# Altium schematic sheet LightLinkV2.SchDoc
size B; SheetNumber: 1; SheetTotal: 4
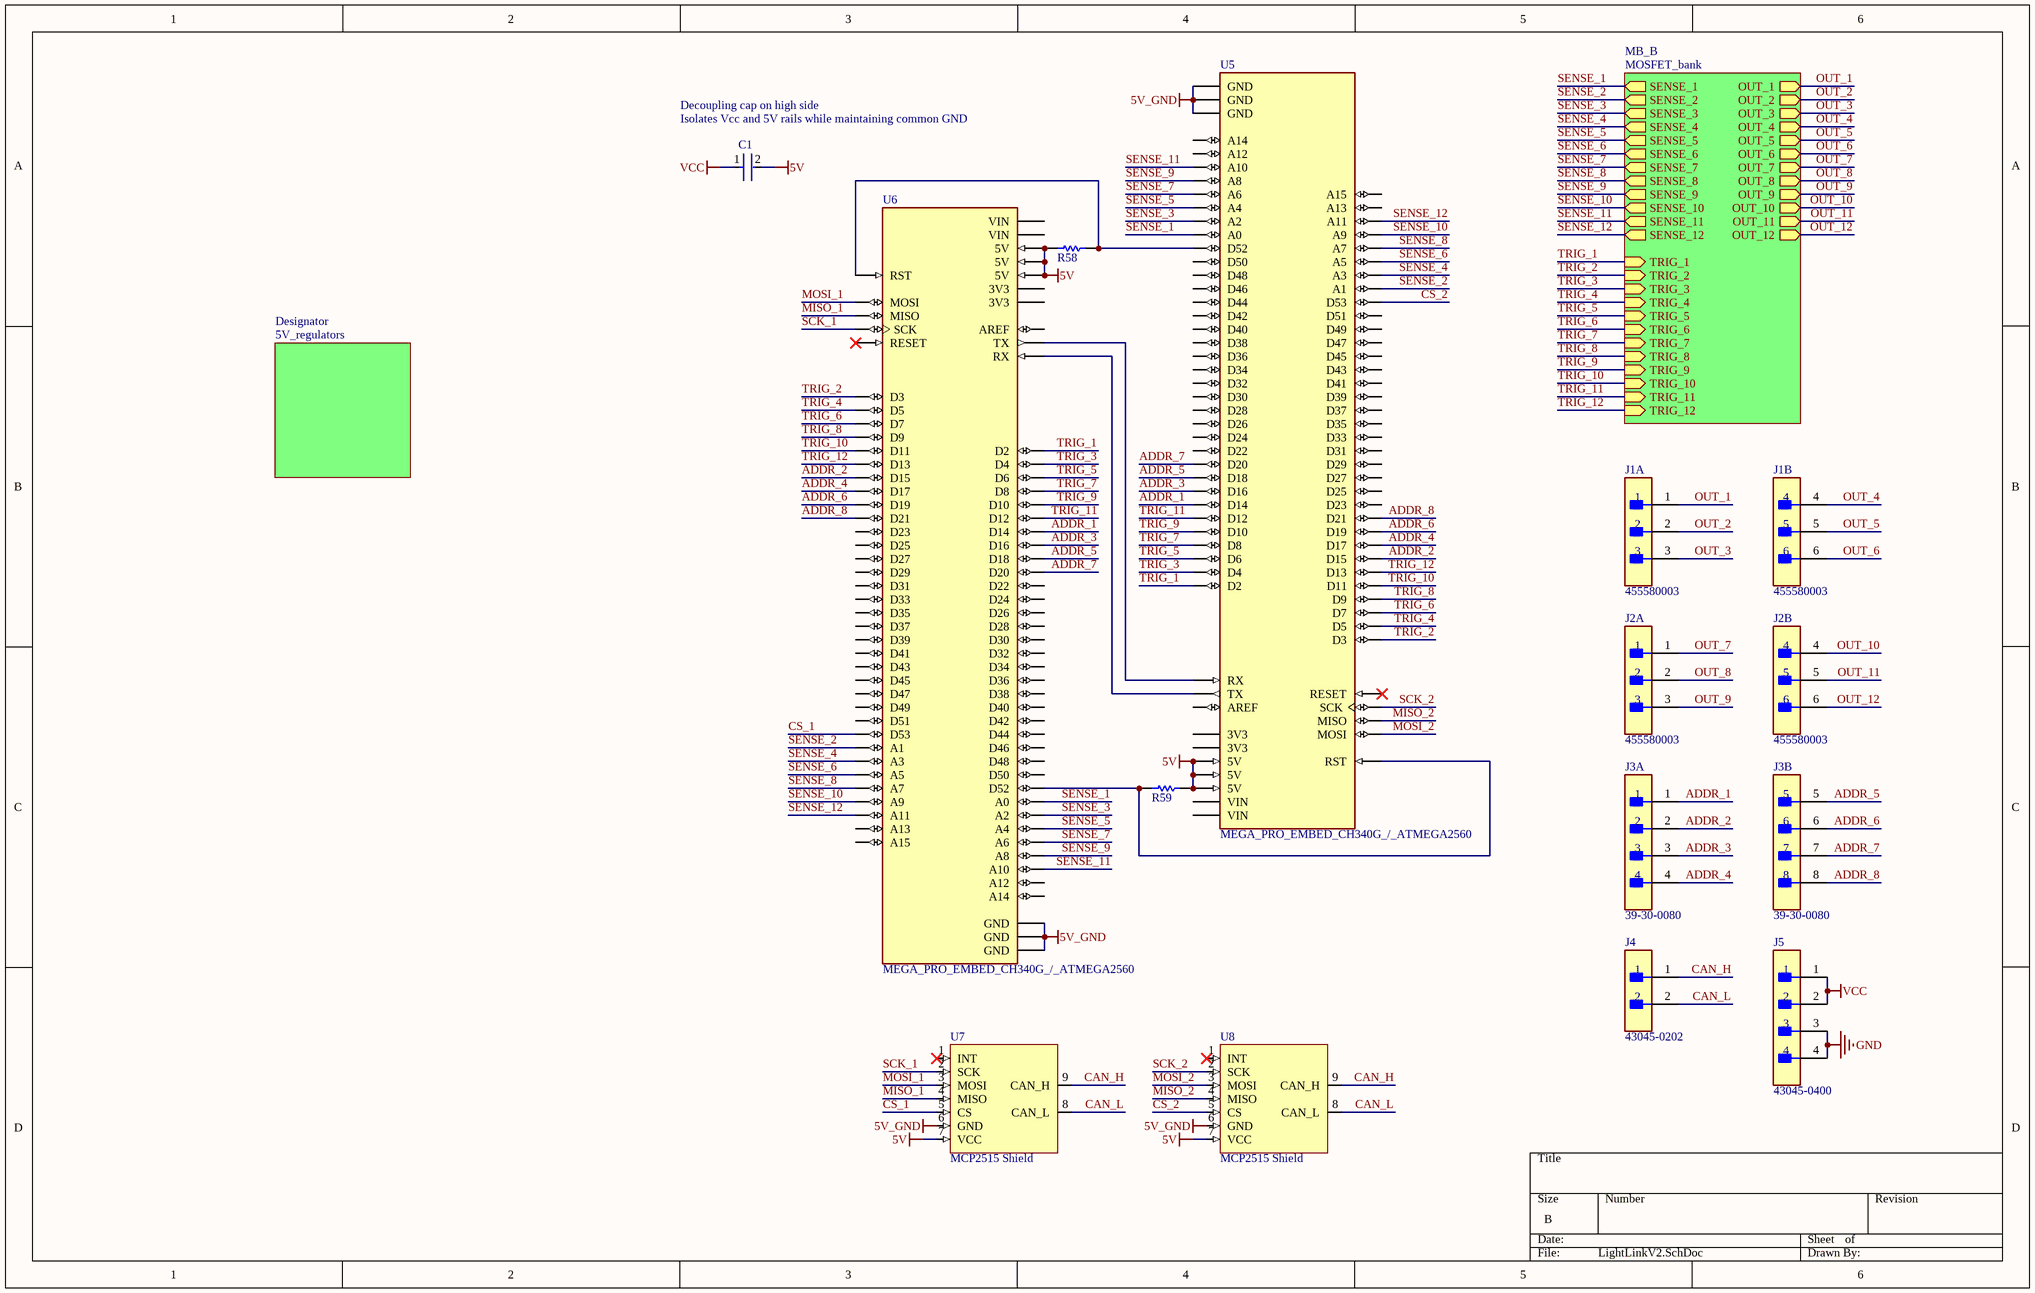
[diagram p0: LightLinkV2.SchDoc]

## Parts
C1  C0603C103K5RACTU  [FP-C0603C-CF-MFG]  (value not drawn)
J1  455580003  [FP-455580003-MFG]  (parts A,B of 2)
J2  455580003  [FP-455580003-MFG]  (parts A,B of 2)
J3  39-30-0080  [FP-39-30-0080-MFG]  (parts A,B of 2)
J4  43045-0202  [FP-43045-0202-MFG]
J5  43045-0400  [FP-43045-0400-MFG]
R58  ERJ3EKF1002V  [RESC1609X55X30LL15T15]  (value not drawn)
R59  ERJ3EKF1002V  [RESC1609X55X30LL15T15]  (value not drawn)
U5  MEGA_PRO_EMBED_CH340G_/_ATMEGA2560  [MODULE_MEGA_PRO_EMBED_CH340G_/_ATMEGA2560]
U6  MEGA_PRO_EMBED_CH340G_/_ATMEGA2560  [MODULE_MEGA_PRO_EMBED_CH340G_/_ATMEGA2560]
U7  MCP2515 Shield  [MCP2515 Shield-Footprint-1]
U8  MCP2515 Shield  [MCP2515 Shield-Footprint-1]

## Sub-sheets
Designator = 5V_regulators: no entries
MB_B = MOSFET_bank: SENSE_1 (out), SENSE_2 (out), SENSE_3 (out), SENSE_4 (out), TRIG_1 (in), OUT_1 (out), TRIG_2 (in), OUT_2 (out), TRIG_3 (in), OUT_3 (out), TRIG_4 (in), OUT_4 (out), SENSE_5 (out), SENSE_6 (out), SENSE_7 (out), SENSE_8 (out), TRIG_5 (in), OUT_5 (out), TRIG_6 (in), OUT_6 (out), TRIG_7 (in), OUT_7 (out), TRIG_8 (in), OUT_8 (out), SENSE_9 (out), SENSE_10 (out), SENSE_11 (out), SENSE_12 (out), TRIG_9 (in), OUT_9 (out), TRIG_10 (in), OUT_10 (out), TRIG_11 (in), OUT_11 (out), TRIG_12 (in), OUT_12 (out)

## Nets
5V: C1.2 R58.2 R59.1 U5.5V_1(5V) U5.5V_2(5V) U5.5V_3(5V) U6.5V_1(5V) U6.5V_2(5V) U6.5V_3(5V) U7.7(VCC) U8.7(VCC)
5V_GND: U5.GND_1(GND) U5.GND_2(GND) U5.GND_3(GND) U6.GND_1(GND) U6.GND_2(GND) U6.GND_3(GND) U7.6(GND) U8.6(GND)
GND: J5.3 J5.4
VCC: C1.1 J5.1 J5.2
ADDR_1: J3.1 U5.D14 U6.D14
ADDR_2: J3.2 U5.D15 U6.D15
ADDR_3: J3.3 U5.D16 U6.D16
ADDR_4: J3.4 U5.D17 U6.D17
ADDR_5: J3.5 U5.D18 U6.D18
ADDR_6: J3.6 U5.D19 U6.D19
ADDR_7: J3.7 U5.D20 U6.D20
ADDR_8: J3.8 U5.D21 U6.D21
CAN_H: J4.1 U7.9(CAN_H) U8.9(CAN_H)
CAN_L: J4.2 U7.8(CAN_L) U8.8(CAN_L)
CS_1: U6.D53 U7.5(CS)
CS_2: U5.D53 U8.5(CS)
MISO_1: U6.MISO U7.4(MISO)
MISO_2: U5.MISO U8.4(MISO)
MOSI_1: U6.MOSI U7.3(MOSI)
MOSI_2: U5.MOSI U8.3(MOSI)
OUT_1: J1.1 ; sheet MB_B/OUT_1
OUT_2: J1.2 ; sheet MB_B/OUT_2
OUT_3: J1.3 ; sheet MB_B/OUT_3
OUT_4: J1.4 ; sheet MB_B/OUT_4
OUT_5: J1.5 ; sheet MB_B/OUT_5
OUT_6: J1.6 ; sheet MB_B/OUT_6
OUT_7: J2.1 ; sheet MB_B/OUT_7
OUT_8: J2.2 ; sheet MB_B/OUT_8
OUT_9: J2.3 ; sheet MB_B/OUT_9
OUT_10: J2.4 ; sheet MB_B/OUT_10
OUT_11: J2.5 ; sheet MB_B/OUT_11
OUT_12: J2.6 ; sheet MB_B/OUT_12
SCK_1: U6.SCK U7.2(SCK)
SCK_2: U5.SCK U8.2(SCK)
SENSE_1: U5.A0 U6.A0 ; sheet MB_B/SENSE_1
SENSE_2: U5.A1 U6.A1 ; sheet MB_B/SENSE_2
SENSE_3: U5.A2 U6.A2 ; sheet MB_B/SENSE_3
SENSE_4: U5.A3 U6.A3 ; sheet MB_B/SENSE_4
SENSE_5: U5.A4 U6.A4 ; sheet MB_B/SENSE_5
SENSE_6: U5.A5 U6.A5 ; sheet MB_B/SENSE_6
SENSE_7: U5.A6 U6.A6 ; sheet MB_B/SENSE_7
SENSE_8: U5.A7 U6.A7 ; sheet MB_B/SENSE_8
SENSE_9: U5.A8 U6.A8 ; sheet MB_B/SENSE_9
SENSE_10: U5.A9 U6.A9 ; sheet MB_B/SENSE_10
SENSE_11: U5.A10 U6.A10 ; sheet MB_B/SENSE_11
SENSE_12: U5.A11 U6.A11 ; sheet MB_B/SENSE_12
TRIG_1: U5.D2 U6.D2 ; sheet MB_B/TRIG_1
TRIG_2: U5.D3 U6.D3 ; sheet MB_B/TRIG_2
TRIG_3: U5.D4 U6.D4 ; sheet MB_B/TRIG_3
TRIG_4: U5.D5 U6.D5 ; sheet MB_B/TRIG_4
TRIG_5: U5.D6 U6.D6 ; sheet MB_B/TRIG_5
TRIG_6: U5.D7 U6.D7 ; sheet MB_B/TRIG_6
TRIG_7: U5.D8 U6.D8 ; sheet MB_B/TRIG_7
TRIG_8: U5.D9 U6.D9 ; sheet MB_B/TRIG_8
TRIG_9: U5.D10 U6.D10 ; sheet MB_B/TRIG_9
TRIG_10: U5.D11 U6.D11 ; sheet MB_B/TRIG_10
TRIG_11: U5.D12 U6.D12 ; sheet MB_B/TRIG_11
TRIG_12: U5.D13 U6.D13 ; sheet MB_B/TRIG_12
NetR58_1: R58.1 U5.D52 U6.RST
NetR59_2: R59.2 U5.RST U6.D52
NetU5_RX: U5.RX U6.TX
NetU5_TX: U5.TX U6.RX

Not connected (* = marked no-connect by the designer): U5 3V3_1(3V3) 3V3_2(3V3) A12 A13 A14 A15 AREF D22 D23 D24 D25 D26 D27 D28 D29 D30 D31 D32 D33 D34 D35 D36 D37 D38 D39 D40 D41 D42 D43 D44 D45 D46 D47 D48 D49 D50 D51 RESET* VIN_1(VIN) VIN_2(VIN); U6 3V3_1(3V3) 3V3_2(3V3) A12 A13 A14 A15 AREF D22 D23 D24 D25 D26 D27 D28 D29 D30 D31 D32 D33 D34 D35 D36 D37 D38 D39 D40 D41 D42 D43 D44 D45 D46 D47 D48 D49 D50 D51 RESET* VIN_1(VIN) VIN_2(VIN); U7 1(INT)*; U8 1(INT)*

## Notes on the sheet
- Decoupling cap on high side
- (near C1) Isolates Vcc and 5V rails while maintaining common GND

## Library data of the parts
C1 = CMP-2006-03046-3: CAP CER 10000PF 50V X7R 0603; Manufacturer: KEMET; Temperature Coefficient: 30ppm/°C; Capacitance: 10,000 pF; Automotive Grade: Grade 1; Material: Ceramic; Value: 10,000 pF; Tolerance: 0.1; Voltage Rating: 50 V; Digikey Description: CAP CER 10000PF 50V X7R 0603; ComponentLink2Description: Datasheet; Mouser Description: Ceramic Capacitor 0.01Uf, 50V, X7R, 10%, 0603, Full Reel; ComponentLink2URL: https://api.kemet.com/component-edge/download/datasheet/C0603C100J5GACAUTO.pdf; Package: C0603C-CF; RoHS: TRUE; Octopart: https://octopart.com/c0603c103k5ractu-kemet-133094; Device Class L1: Passive Components; Manufacturer Part Number: C0603C103K5RACTU; Temperature Range Low: -55°C; Automotive: Yes; Category: Cap; Lead Free: Yes; Temperature: -55°C to +125°C; Temperature Range High: +125°C; Temperature Characteristic: X7R; Height: 0.87mm; Device Class L3: Ceramic Capacitors; Device Class L2: Capacitors
J1 J2 = CMP-04776-000024-1: CONN HEADER R/A 6POS 4.2MM; Manufacturer: Molex; Standoff Height: 0.4mm; Conn Orientation: Right Angle; Number Of Contacts: 6; Conn Gender: Male; Voltage Rating: 600V; Current Rating: 8A; Footprint Url: https://www.molex.com/pdm_docs/sd/455580003_sd.pdf; Number Of Rows: 2; Lead Free: Yes; Digikey Description: CONN HEADER R/A 6POS 4.2MM; ComponentLink2URL: https://www.molex.com/webdocs/datasheets/pdf/en-us/0455580003_PCB_HEADERS.pdf; Octopart: https://octopart.com/45558-0003-molex-7672845; Package: 0; Device Class L3: unset; ComponentLink2Description: Datasheet; Device Class L2: Headers and Wire Housings; Category: Conn; Contact Material: Tin,Nickel; Mouser Description: Conn Power HDR 6 POS 4.2mm Solder ST Thru-Hole 6 Terminal 1 Port Mini-Fit Jr™ Tray; Manufacturer Part Number: 455580003; Pitch: 4.2mm; Device Class L1: Connectors; Temperature Range Low: -40°C; Temperature: -40°C to +105°C; RoHS: TRUE; Temperature Range High: +105°C; Height: 10.38mm; Automotive: No
J3 = CMP-04776-000387-1: CONN HEADER R/A 8POS 4.2MM; Number of Contacts: 8; Max Voltage Rating (AC): 600V; Insulation Resistance: 1GR; Contact Resistance: 10mR; Max Current Rating: 7A; Gender: Male; Row Spacing: 0.165inch; Approvals: UL; Number of Ports: 1; Current Rating: 13A; Glow Wire Compliant: Non-compliant; Pitch: 4.2mm; Housing Material: Nylon; Color: Natural; Max Operating Temperature: 105°C; Packaging: Bag; Termination: Solder; Flammability Rating: UL94 V-0; Width: 11.4mm; Contact Plating: Tin; Material: Nylon; Mount: Through Hole; Height: 11.4mm; Halogen Free: Low Halogen; Depth: 19.4mm; ELV: Compliant; Number of Terminals/Pins: 8; Orientation: Right Angle; Number of Positions: 8; Contact Material: Brass; Number of Rows: 2; Lead Free: Lead Free; Contact Type: Male Pin; Min Operating Temperature: -40°C; Fastening Type: Ramp; Package Quantity: 225; Voltage Rating (DC): 600V; Number of Circuits: 8; Housing Color: Natural; Voltage Rating: 600V; Series: Mini-Fit® Jr™ 5569; Contact Gender: Male; Length: 18mm
J4 = CMP-04776-000660-1: CONN HEADER R/A 2POS; Number of Contacts: 2; Current Rating: 5A; Gender: Male; Contact Resistance: 10mR; Voltage Rating (DC): 250V; Glow Wire Compliant: Compliant; Voltage Rating: 600V; Pitch: 3mm; Max Voltage Rating (DC): 250.25kV; Insulation Resistance: 1GR; Radiation Hardening: No; Halogen Free: Low Halogen; Number of Positions: 2; Mount: Through Hole; RoHS Compliant: Yes; Lead Free: Contains Lead; Color: Black; Max Current Rating: 5A; Length: 7.15mm; Orientation: Right Angle; Termination: Solder; Height: 8.77mm; Flammability Rating: UL94 V-0; Diameter: 3mm; Min Operating Temperature: -40°C; Series: Micro-Fit 3.0; Max Operating Temperature: 105°C; Number of Circuits: 2; Number of Rows: 2; Depth: 12.2mm; Housing Color: Black; Contact Plating: Gold; Case/Package: SMC; Contact Material: Brass; Packaging: Tray; Housing Material: Thermoplastic; Package Quantity: 3168
J5 = CMP-04776-000002-1: CONN HEADER R/A 4POS 3MM; Manufacturer: Molex; Conn Gender: Male; Conn Orientation: Right Angle; Voltage Rating: 600V; Number Of Contacts: 4; Is Female: yes; Current Rating: 8.5A; ComponentLink2URL: https://www.molex.com/webdocs/datasheets/pdf/en-us/0430450400_PCB_HEADERS.pdf; Manufacturer Part Number: 43045-0400; Digikey Description: CONN HEADER R/A 4POS 3MM; Category: Conn; Temperature Range High: +105°C; Lead Free: Yes; Device Class L1: Connectors; Automotive: No; Temperature: -40°C to +105°C; Footprint Url: https://www.molex.com/pdm_docs/sd/430450400_sd.pdf; Height: 9.27mm; Number Of Rows: 2; Device Class L3: unset; Pitch: 3mm; Temperature Range Low: -40°C; Contact Material: Tin,Nickel; Octopart: https://octopart.com/43045-0400-molex-287063; RoHS: TRUE; ComponentLink2Description: Datasheet; Package: 43045-0400; Device Class L2: Headers and Wire Housings
R58 R59 = CMP-1012-00623-3: Chip Resistor, 10 KOhm, +/- 1%, 0.1 W, -55 to 155 degC, 0603 (1608 Metric), RoHS, Tape and Reel; Manufacturer: Panasonic; Voltage Rating: 75V; Case\/Package: 0603; Power Rating: 100mW; Resistance: 10KOhm; Temperature Coefficient: 100ppm\/degreesC; Number of Pins: 2; Package Reference: 603; Depth: 0.8mm; Mount: SurfaceMount; Package Description: 2-Pin Surface Mount Device, Body 1.6 x 0.85 mm; Datasheet Version: 02/2017; Length: 1.6mm; Lead Free: LeadFree; Height: 0.45mm; Number of Terminations: 2; Max Power Dissipation: 100mW; Min Operating Temperature: -55degC; Datasheet URL: https://industrial.panasonic.com/cdbs/www-data/pdf/RDA0000/AOA0000C304.pdf; Termination: SMD/SMT; Case Code (Metric): 1608; Case Code (Imperial): 0603; Tolerance: 1%; Max Operating Temperature: 155degC; RoHSCompliant: true; Voltage Rating (DC): 75V; Radiation Hardening: No; Packaging: TapeandReel; Composition: ThickFilm; Mounting Technology: SurfaceMount; Manufacturer URL: http://www.panasonic.com/; Width: 0.031inch; REACH SVHC: NoSVHC; Contact Plating: Tin; Military Standard: Not; Package Quantity: 1
U5 U6 = CMP-002-000002-2: Mega 2560 PRO (Embed) CH340G/ATmega2560-16AU; Component Type: Standard; Design Item ID: MEGA_PRO_EMBED_CH340G_/_ATMEGA2560; Price: None; Pin Count: 86; Source: MEGA_PRO_EMBED_CH340G___ATMEGA2560.SchLib; Value: *; Availability: Unavailable; MP: MEGA_PRO_EMBED_CH340G_/_ATMEGA2560; Package: None
U7 U8 = CMP-015-00008-2: PCB layout of Arduino MCP2515 shield to avoid remaking the schematic and ordering individual components when I already have a dozen shields on hand.